# Altium schematic sheet ArduinoUnoShield.SchDoc
size A4
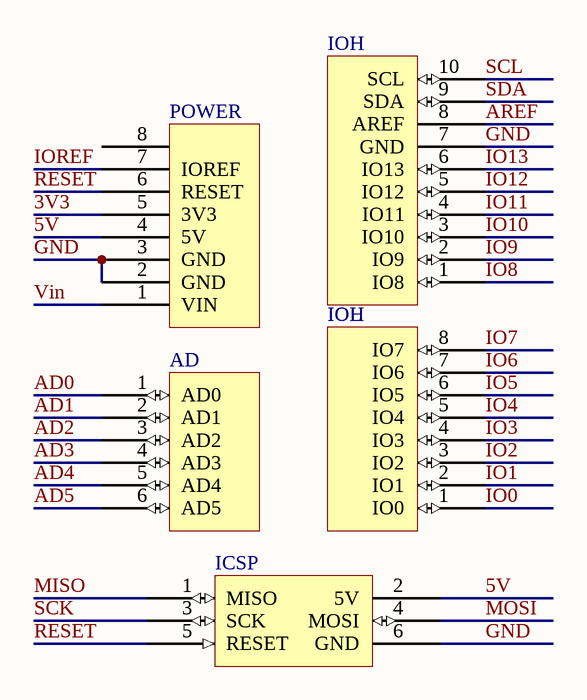
[diagram p0: ArduinoUnoShield.SchDoc]

## Parts
AD  AD  [Header 6x1 8.5mm]  (value not drawn)
ICSP  ICSP  [ICSP]  (value not drawn)
IOH  IOH  [Header 10x1 8.5mm]
IOL  IOL  [Header 8x1 8.5mm]  (value not drawn)
POWER  POWER_UNO  [Header 8x1 8.5mm]  (value not drawn)

## Nets
3V3: POWER.5(3V3)
5V: ICSP.2(5V) POWER.4(5V)
AD0: AD.1(AD0)
AD1: AD.2(AD1)
AD2: AD.3(AD2)
AD3: AD.4(AD3)
AD4: AD.5(AD4)
AD5: AD.6(AD5)
AREF: IOH.8(AREF)
GND: ICSP.6(GND) IOH.7(GND) POWER.2(GND) POWER.3(GND)
IO0: IOL.1(IO0)
IO1: IOL.2(IO1)
IO2: IOL.3(IO2)
IO3: IOL.4(IO3)
IO4: IOL.5(IO4)
IO5: IOL.6(IO5)
IO6: IOL.7(IO6)
IO7: IOL.8(IO7)
IO8: IOH.1(IO8)
IO9: IOH.2(IO9)
IO10: IOH.3(IO10)
IO11: IOH.4(IO11)
IO12: IOH.5(IO12)
IO13: IOH.6(IO13)
IOREF: POWER.7(IOREF)
MISO: ICSP.1(MISO)
MOSI: ICSP.4(MOSI)
RESET: ICSP.5(RESET) POWER.6(RESET)
SCK: ICSP.3(SCK)
SCL: IOH.10(SCL)
SDA: IOH.9(SDA)
Vin: POWER.1(VIN)

Not connected (* = marked no-connect by the designer): POWER 8